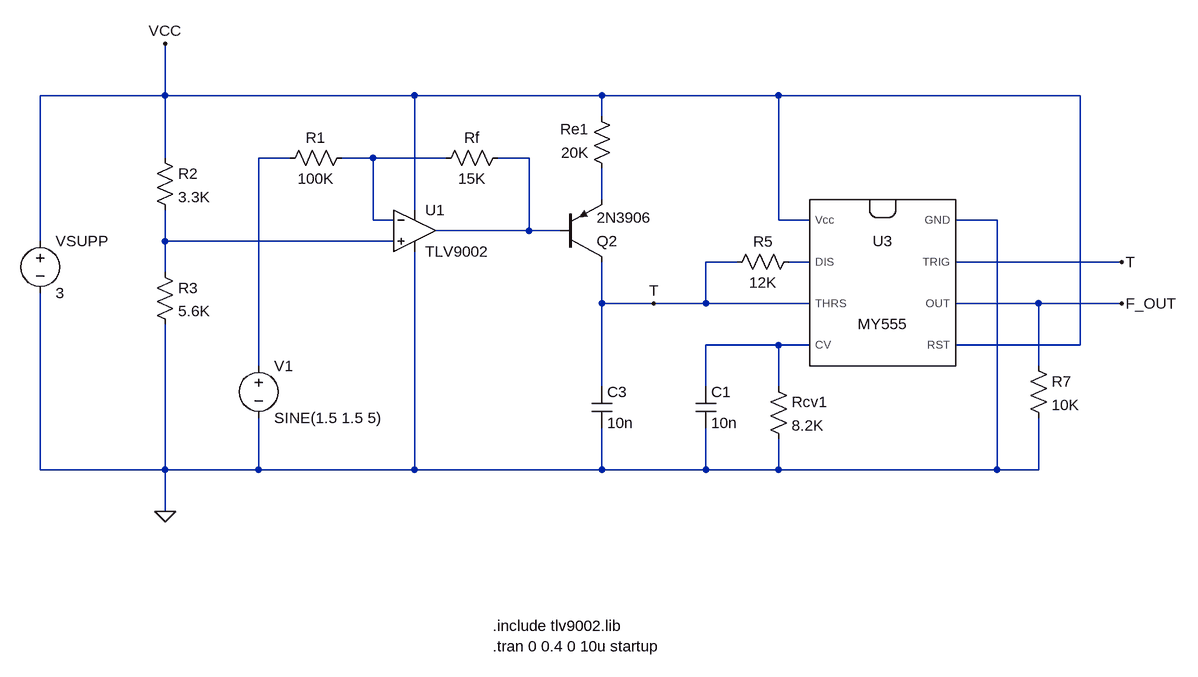
[diagram p0: schematic tx.asc]
tx.asc, the LTspice schematic file:
Version 4.1
SHEET 1 2272 932
WIRE -352 -80 -352 -160
WIRE -352 -80 -544 -80
WIRE 32 -80 -352 -80
WIRE 320 -80 32 -80
WIRE 592 -80 320 -80
WIRE 1056 -80 592 -80
WIRE 320 -48 320 -80
WIRE -352 16 -352 -80
WIRE -160 16 -208 16
WIRE -32 16 -80 16
WIRE 80 16 -32 16
WIRE 208 16 160 16
WIRE 320 80 320 32
WIRE 32 96 32 -80
WIRE -32 112 -32 16
WIRE 0 112 -32 112
WIRE 592 112 592 -80
WIRE 640 112 592 112
WIRE 928 112 864 112
WIRE 208 128 208 16
WIRE 208 128 64 128
WIRE 256 128 208 128
WIRE -544 144 -544 -80
WIRE -352 144 -352 96
WIRE 0 144 -352 144
WIRE 528 176 480 176
WIRE 640 176 608 176
WIRE 1120 176 864 176
WIRE -352 192 -352 144
WIRE 320 240 320 176
WIRE 400 240 320 240
WIRE 480 240 480 176
WIRE 480 240 400 240
WIRE 640 240 480 240
WIRE 992 240 864 240
WIRE 1120 240 992 240
WIRE 592 304 480 304
WIRE 640 304 592 304
WIRE 1056 304 1056 -80
WIRE 1056 304 864 304
WIRE -208 336 -208 16
WIRE 992 336 992 240
WIRE 320 368 320 240
WIRE 480 368 480 304
WIRE 592 368 592 304
WIRE -544 496 -544 224
WIRE -352 496 -352 272
WIRE -352 496 -544 496
WIRE -208 496 -208 416
WIRE -208 496 -352 496
WIRE 32 496 32 160
WIRE 32 496 -208 496
WIRE 320 496 320 432
WIRE 320 496 32 496
WIRE 480 496 480 432
WIRE 480 496 320 496
WIRE 592 496 592 448
WIRE 592 496 480 496
WIRE 928 496 928 112
WIRE 928 496 592 496
WIRE 992 496 992 416
WIRE 992 496 928 496
WIRE -352 560 -352 496
FLAG -352 -160 VCC
FLAG -352 560 0
FLAG 400 240 T
FLAG 1120 176 T
FLAG 1120 240 F_OUT
SYMBOL OpAmps\\TLV9002 32 64 R0
SYMATTR InstName U1
SYMATTR SpiceModel ""
SYMBOL voltage -208 320 R0
WINDOW 123 0 0 Left 0
WINDOW 39 0 0 Left 0
SYMATTR InstName V1
SYMATTR Value SINE(1.5 1.5 5)
SYMBOL res -64 0 R90
WINDOW 0 0 56 VBottom 2
WINDOW 3 32 56 VTop 2
SYMATTR InstName R1
SYMATTR Value 100K
SYMBOL res 176 0 R90
WINDOW 0 0 56 VBottom 2
WINDOW 3 32 56 VTop 2
SYMATTR InstName Rf
SYMATTR Value 15K
SYMBOL res -368 0 R0
SYMATTR InstName R2
SYMATTR Value 3.3K
SYMBOL res -368 176 R0
SYMATTR InstName R3
SYMATTR Value 5.6K
SYMBOL voltage -544 128 R0
WINDOW 123 0 0 Left 0
WINDOW 39 0 0 Left 0
SYMATTR InstName VSUPP
SYMATTR Value 3
SYMBOL pnp 256 176 M180
SYMATTR InstName Q2
SYMATTR Value 2N3906
SYMBOL res 336 48 R180
WINDOW 0 36 76 Left 2
WINDOW 3 36 40 Left 2
SYMATTR InstName Re1
SYMATTR Value 20K
SYMBOL cap 304 368 R0
SYMATTR InstName C3
SYMATTR Value 10n
SYMBOL Misc\\mysymbol 752 208 M0
SYMATTR InstName U3
SYMBOL res 624 160 R90
WINDOW 0 0 56 VBottom 2
WINDOW 3 32 56 VTop 2
SYMATTR InstName R5
SYMATTR Value 12K
SYMBOL cap 464 368 R0
SYMATTR InstName C1
SYMATTR Value 10n
SYMBOL res 576 352 R0
SYMATTR InstName Rcv1
SYMATTR Value 8.2K
SYMBOL res 976 320 R0
SYMATTR InstName R7
SYMATTR Value 10K
TEXT 152 736 Left 2 !.include tlv9002.lib
TEXT 152 768 Left 2 !.tran 0 0.4 0 10u startup

The netlist it stands for:
* tx.asc
X§U1 N005 N002 VCC 0 N003 TLV9002  ; pins In+ In- V+ V- OUT
V1 N001 0 SINE(1.5 1.5 5)
R1 N002 N001 100K
Rf N003 N002 15K
R2 VCC N005 3.3K
R3 N005 0 5.6K
VSUPP VCC 0 3
Q2 T N003 N004 0 2N3906
Re1 N004 VCC 20K
C3 T 0 10n
X§U3 0 T F_OUT VCC N007 T N006 VCC MY555  ; pins GND TRIG OUT RST CV THRS DIS Vcc
R5 N006 T 12K
C1 N007 0 10n
Rcv1 N007 0 8.2K
R7 F_OUT 0 10K
.model NPN NPN
.model PNP PNP
.lib standard.bjt
.include tlv9002.lib
.tran 0 0.4 0 10u startup
.lib MY555.sub
.backanno
.end